# EAGLE design main_shema (EAGLE 8.5.2)
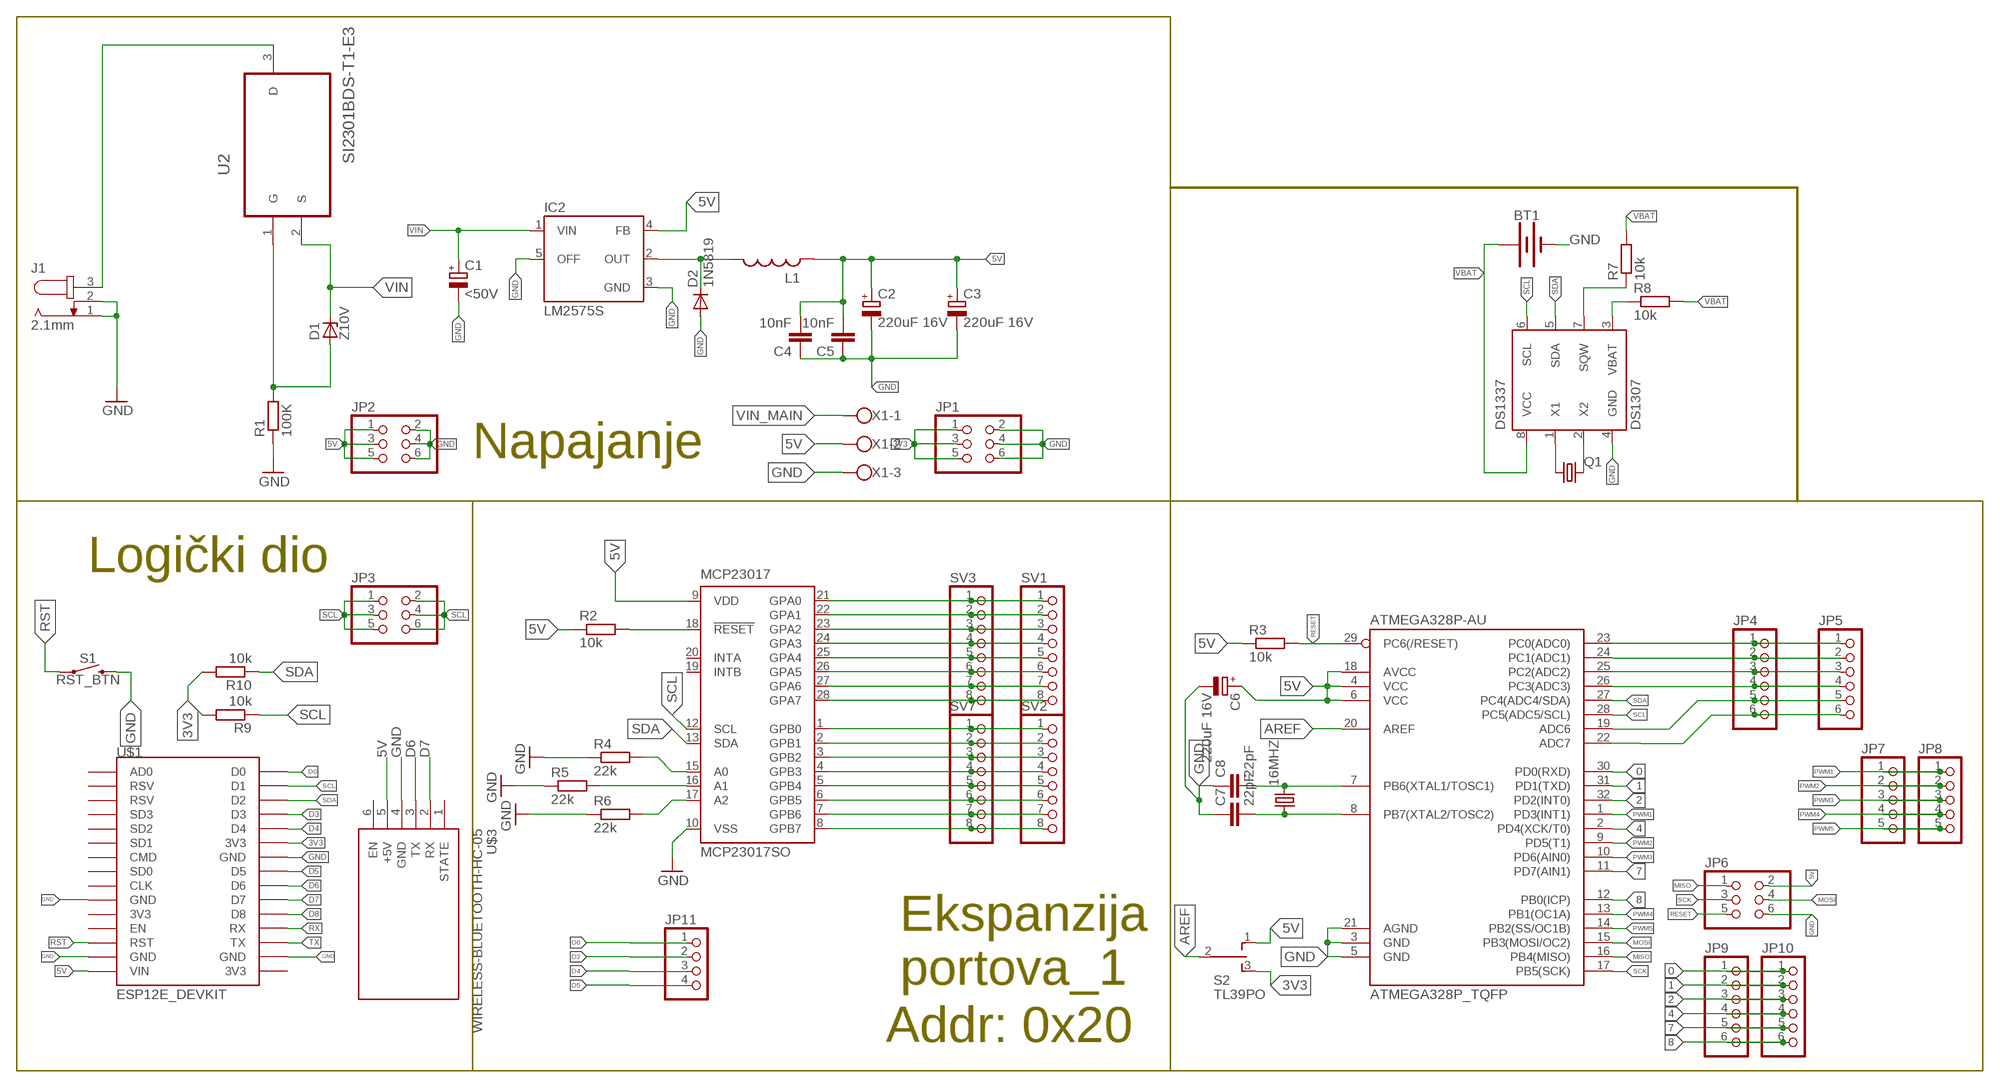
[diagram p0: schematic, sheet 1]

## Parts
16MHZ  CRYSTALHC49S  [HC49/S]
ATMEGA328P-AU  ATMEGA328P_TQFP  [TQFP32-08]
BT1  BATTERY-20MM_PTH  [BATTCOM_20MM_PTH]
C1  <50V  CPOL-EUE3.5-8  [E3,5-8]
C2  220uF 16V  CPOL-EUE2-5  [E2-5]
C3  220uF 16V  CPOL-EUE2-5  [E2-5]
C4  10nF  C-EU025-024X044  [C025-024X044]
C5  10nF  C-EU025-024X044  [C025-024X044]
C6  220uF 16V  CPOL-EUE2-5  [E2-5]
C7  22pF  C-EU025-024X044  [C025-024X044]
C8  22pF  C-EU025-024X044  [C025-024X044]
D1  Z10V  ZENER-DIODEDO35Z10  [DO35Z10]
D2  1N5819  1N4004  [DO41-10]
DS1337  DS1307  [DIL08]
IC2  LM2575S  [TO263-5]
J1  2.1mm  JACK-PLUG1  [SPC4078]
JP1  PINHD-2X3  [2X03]
JP2  PINHD-2X3  [2X03]
JP3  PINHD-2X3  [2X03]
JP4  PINHD-1X6  [1X06]
JP5  PINHD-1X6  [1X06]
JP6  PINHD-2X3  [2X03]
JP7  PINHD-1X5  [1X05]
JP8  PINHD-1X5  [1X05]
JP9  PINHD-1X6  [1X06]
JP10  PINHD-1X6  [1X06]
JP11  PINHD-1X4  [1X04]
L1  MSS1260  [MSS1260]
MCP23017  MCP23017SO  [SO28W]
Q1  CRYSTALTC38H  [TC38H]
R1  100K  R-EU_R1206  [R1206]
R2  10k  R-EU_R1206  [R1206]
R3  10k  R-EU_R1206  [R1206]
R4  22k  R-EU_R1206  [R1206]
R5  22k  R-EU_R1206  [R1206]
R6  22k  R-EU_R1206  [R1206]
R7  10k  R-EU_R1206  [R1206]
R8  10k  R-EU_R1206  [R1206]
R9  10k  R-EU_R1206  [R1206]
R10  10k  R-EU_R1206  [R1206]
S1  RST_BTN  MOMENTARY-SWITCH-SPST-PTH-6.0MM  [TACTILE_SWITCH_PTH_6.0MM]
S2  TL39PO  [TL3XPO]
SV1  PINHD-1X8  [1X08]
SV2  PINHD-1X8  [1X08]
SV3  PINHD-1X8  [1X08]
SV7  PINHD-1X8  [1X08]
U2  SI2301BDS-T1-E3  [SOT95P237X112-3N]
U$1  ESP12E_DEVKIT  [ESP12E_DEVKIT]
U$3  WIRELESS-BLUETOOTH-HC-05  [WIRELESS-BLUETOOTH-HC-05]
X1  W237-103  [W237-103]

## Nets
0: ATMEGA328P-AU.30(PD0(RXD)) JP9.1 JP10.1
1: ATMEGA328P-AU.31(PD1(TXD)) JP9.2 JP10.2
2: ATMEGA328P-AU.32(PD2(INT0)) JP9.3 JP10.3
3V3: JP1.1 JP1.3 JP1.5 R9.2 R10.2 S2.3(S) U$1.3V3@1(3V3)
4: ATMEGA328P-AU.2(PD4(XCK/T0)) JP9.4 JP10.4
5V: ATMEGA328P-AU.4(VCC) ATMEGA328P-AU.6(VCC) ATMEGA328P-AU.18(AVCC) C2.+ C3.+ C4.2 C5.2 C6.+ IC2.4(FB) JP2.1 JP2.3 JP2.5 JP6.2 L1.P$2 MCP23017.9(VDD) R2.1 R3.1 S2.1(O) U$1.VIN U$3.5(+5V) X1.2
7: ATMEGA328P-AU.11(PD7(AIN1)) JP9.5 JP10.5
8: ATMEGA328P-AU.12(PB0(ICP)) JP9.6 JP10.6
AREF: ATMEGA328P-AU.20(AREF) S2.2(P)
D0: JP11.1 U$1.D0
D3: JP11.2 U$1.D3
D4: JP11.3 U$1.D4
D5: JP11.4 U$1.D5
D6: U$1.D6 U$3.3(TX)
D7: U$1.D7 U$3.2(RX)
D8: U$1.D8
GND: ATMEGA328P-AU.3(GND) ATMEGA328P-AU.5(GND) ATMEGA328P-AU.21(AGND) BT1.2(-) C1.- C2.- C3.- C4.1 C5.1 C6.- C7.1 C8.1 D2.A DS1337.4(GND) IC2.3(GND) IC2.5(OFF) J1.1 J1.2 JP1.2 JP1.4 JP1.6 JP2.2 JP2.4 JP2.6 JP6.6 MCP23017.10(VSS) R1.1 R4.1 R5.1 R6.1 S1.3 U$1.GND@0(GND) U$1.GND@1(GND) U$1.GND@2(GND) U$1.GND@3(GND) U$3.4(GND) X1.3
MISO: ATMEGA328P-AU.16(PB4(MISO)) JP6.1
MOSI: ATMEGA328P-AU.15(PB3(MOSI/OC2)) JP6.4
N$1: DS1337.1(X1) Q1.1
N$2: D1.A R1.2 U2.1(G)
N$3: MCP23017.21(GPA0) SV1.1 SV3.1
N$4: MCP23017.22(GPA1) SV1.2 SV3.2
N$5: MCP23017.15(A0) R4.2
N$6: MCP23017.16(A1) R5.2
N$7: MCP23017.17(A2) R6.2
N$8: D2.C IC2.2(OUT) L1.P$1
N$9: DS1337.2(X2) Q1.2
N$10: ATMEGA328P-AU.22(ADC7) JP4.6 JP5.6
N$11: MCP23017.23(GPA2) SV1.3 SV3.3
N$13: DS1337.3(VBAT) R8.1
N$14: DS1337.7(SQW) R7.1
N$15: MCP23017.24(GPA3) SV1.4 SV3.4
N$16: MCP23017.25(GPA4) SV1.5 SV3.5
N$17: MCP23017.26(GPA5) SV1.6 SV3.6
N$18: MCP23017.18(!RESET) R2.2
N$19: 16MHZ.2 ATMEGA328P-AU.7(PB6(XTAL1/TOSC1)) C8.2
N$20: 16MHZ.1 ATMEGA328P-AU.8(PB7(XTAL2/TOSC2)) C7.2
N$21: MCP23017.27(GPA6) SV1.7 SV3.7
N$22: MCP23017.28(GPA7) SV1.8 SV3.8
N$23: MCP23017.1(GPB0) SV2.1 SV7.1
N$24: MCP23017.2(GPB1) SV2.2 SV7.2
N$25: MCP23017.3(GPB2) SV2.3 SV7.3
N$26: MCP23017.4(GPB3) SV2.4 SV7.4
N$27: MCP23017.5(GPB4) SV2.5 SV7.5
N$28: MCP23017.6(GPB5) SV2.6 SV7.6
N$29: MCP23017.7(GPB6) SV2.7 SV7.7
N$30: MCP23017.8(GPB7) SV2.8 SV7.8
N$31: ATMEGA328P-AU.23(PC0(ADC0)) JP4.1 JP5.1
N$32: ATMEGA328P-AU.24(PC1(ADC1)) JP4.2 JP5.2
N$33: ATMEGA328P-AU.25(PC2(ADC2)) JP4.3 JP5.3
N$34: ATMEGA328P-AU.26(PC3(ADC3)) JP4.4 JP5.4
N$35: ATMEGA328P-AU.19(ADC6) JP4.5 JP5.5
PWM1: ATMEGA328P-AU.1(PD3(INT1)) JP7.1 JP8.1
PWM2: ATMEGA328P-AU.9(PD5(T1)) JP7.2 JP8.2
PWM3: ATMEGA328P-AU.10(PD6(AIN0)) JP7.3 JP8.3
PWM4: ATMEGA328P-AU.13(PB1(OC1A)) JP7.4 JP8.4
PWM5: ATMEGA328P-AU.14(PB2(SS/OC1B)) JP7.5 JP8.5
RESET: ATMEGA328P-AU.29(PC6(/RESET)) JP6.5 R3.2
RST: S1.1 U$1.RST
RX: U$1.RX
SCK: ATMEGA328P-AU.17(PB5(SCK)) JP6.3
SCL: ATMEGA328P-AU.28(PC5(ADC5/SCL)) DS1337.6(SCL) JP3.1 JP3.3 JP3.5 MCP23017.12(SCL) R9.1 U$1.D1
SDA: ATMEGA328P-AU.27(PC4(ADC4/SDA)) DS1337.5(SDA) JP3.2 JP3.4 JP3.6 MCP23017.13(SDA) R10.1 U$1.D2
TX: U$1.TX
VBAT: BT1.1(+) DS1337.8(VCC) R7.2 R8.2
VIN: C1.+ D1.C IC2.1(VIN) U2.2(S)
VIN_MAIN: J1.3 U2.3(D) X1.1
Unconnected: MCP23017.19(INTB) MCP23017.20(INTA) U$1.3V3@0(3V3) U$1.3V3@2(3V3) U$1.AD0 U$1.CLK U$1.CMD U$1.EN U$1.RSV@0(RSV) U$1.RSV@1(RSV) U$1.SD0 U$1.SD1 U$1.SD2 U$1.SD3 U$3.1(STATE) U$3.6(EN)

## Notes on the sheet
- Napajanje
- Logički dio
- Ekspanzija
  portova_1
- Addr: 0x20

## Library data of the parts
16MHZ = crystal:CRYSTAL: CRYSTAL; OC_FARNELL: 1667008; OC_NEWARK: unknown
ATMEGA328P-AU = SparkFun-IC-Microcontroller:ATMEGA328P_TQFP: Popular 328P in QFP Storefront component: ATmega328 - TQFP <https://www.sparkfun.com/products/13448> (COM-13448) Datasheet <http://www.sparkfun.com/datasheets/Components/SMD/ATMega328.pdf> SparkFun Products SparkFun RedBoard - Programmed with Arduino <https://www.sparkfun.com/products/12757> (DEV-12757) Arduino Pro Mini 328 - 5V/16MHz <https://www.sparkfun.com/products/11113> (DEV-11113) Arduino Pro Mini 328 - 3.3V/8MHz <https://www.sparkfun.com/products/11114> (DEV-11114) SparkFun OpenLog <https://www.sparkfun.com/products/13712> (DEV-13712) SparkFun MicroView - OLED Arduino Module <https://www.sparkfun.com/products/12923> (DEV-12923) SparkFun Digital Sandbox <https://www.sparkfun.com/products/12651> (DEV-12651) SparkFun PicoBoard <https://www.sparkfun.com/products/11888> (WIG-11888) Arduino Fio <https://www.sparkfun.com/products/10116> (DEV-10116) LilyPad Arduino 328 Main Board <https://www.sparkfun.com/products/13342> (DEV-13342) SparkFun RedStick <https://www.sparkfun.com/products/13741> (DEV-13741) LilyPad MP3 <https://www.sparkfun.com/products/11013> (DEV-11013) LilyPad Arduino SimpleSnap <https://www.sparkfun.com/products/10941> (DEV-10941) SparkFun Stepoko <https://www.sparkfun.com/products/13899> (ROB-13899) SparkFun Geiger Counter <https://www.sparkfun.com/products/11345> (SEN-11345) SparkFun EL Sequencer <https://www.sparkfun.com/products/12781> (COM-12781) Arduino Pro 328 - 5V/16MHz <https://www.sparkfun.com/products/10915> (DEV-10915) CryptoCape <https://www.sparkfun.com/products/12773> (DEV-12773) SparkFun IR Thermometer Evaluation Board - MLX90614 <https://www.sparkfun.com/products/10740> (SEN-10740) SparkFun RedBot Mainboard <https://www.sparkfun.com/products/12097> (ROB-12097) Arduino Pro 328 - 3.3V/8MHz <https://www.sparkfun.com/products/10914> (DEV-10914) SparkFun Block for Intel® Edison - Arduino <https://www.sparkfun.com/products/13036> (DEV-13036) SparkFun Simon Says - Surface Mount Soldering Kit <https://www.sparkfun.com/products/10935> (KIT-10935) SparkFun 7-Segment Serial Display - Red <https://www.sparkfun.com/products/11441> (COM-11441) SparkFun 7-Segment Serial Display - White <https://www.sparkfun.com/products/11629> (COM-11629) SparkFun 7-Segment Serial Display - Yellow <https://www.sparkfun.com/products/11443> (COM-11443) SparkFun 7-Segment Serial Display - Kelly Green <https://www.sparkfun.com/products/11440> (COM-11440) SparkFun 7-Segment Serial Display - Blue <https://www.sparkfun.com/products/11442> (COM-11442) SparkFun OpenSegment Serial Display - 20mm (Blue) <https://www.sparkfun.com/products/11647> (COM-11647) SparkFun OpenSegment Serial Display - 20mm (Green) <https://www.sparkfun.com/products/11646> (COM-11646) SparkFun OpenSegment Serial Display - 20mm (White) <https://www.sparkfun.com/products/11648> (COM-11648) SparkFun OpenSegment Serial Display - 20mm (Red) <https://www.sparkfun.com/products/11644> (COM-11644) SparkFun OpenSegment Serial Display - 20mm (Yellow) <https://www.sparkfun.com/products/11645> (COM-11645) SparkFun OpenSegment Shield <https://www.sparkfun.com/products/13190> (DEV-13190); PROD_ID: IC-09069
BT1 = SparkFun-Batteries:BATTERY: Battery - Single Cell A variety of battery chemistries, sizes, and footprints. Device List: 20MM_PTH - Coin Cell Battery Holder - 20mm (PTH) <https://www.sparkfun.com/products/783> 12MM_SMD - Coin Cell Battery Holder - 12mm (SMD) <https://www.sparkfun.com/products/10592> 12MM_PTH - Coin Cell Battery Holder - 12mm (PTH) <https://www.sparkfun.com/products/7948> 20MM_SMD - 20mm Coin Cell Battery Holder (SMD) (2 legs) Used on the Big Time Watch Kit <https://www.sparkfun.com/products/11734> 20MM_SMD_4LEGS - Coin Cell Battery Holder - 20mm (SMD) <https://www.sparkfun.com/products/11892> 20MM_SMD_4LEGS_OVERPASTE - Coin Cell Battery Holder - 20mm (SMD) <https://www.sparkfun.com/products/11892> (Over-paste on the legs) 24.5MM_PTH - Coin Cell Battery Holder - 24.5mm (PTH) <https://www.sparkfun.com/products/8863> 9V - 9V Battery Holder - PC Mount Used on the SparkFun SparkPunk Sound Kit <https://www.sparkfun.com/products/11177> and SparkFun SparkPunk Sequencer Kit <https://www.sparkfun.com/products/12707> 18650 - Battery Holder - 18650 (PTH) <https://www.sparkfun.com/products/13113> AA - Battery Holder - 1xAA (PTH) <https://www.sparkfun.com/products/7949> AAA - Battery Holder - 1xAAA (PTH) <https://www.sparkfun.com/products/12718> AA_KIT - Battery Holder - 1xAA (PTH) <https://www.sparkfun.com/products/7949> Special kit package - pads only have exposed copper on one side of the board. AAA_KIT - Battery Holder - 1xAAA (PTH) <https://www.sparkfun.com/products/12718> Special kit package - pads only have exposed copper on one side of the board.; PROD_ID: BATT-09031; SF_SKU: PRT-00783
C1-C3 C6 = resistor:CPOL-EU: POLARIZED CAPACITOR, European symbol
C4 C5 C7 C8 = resistor:C-EU: CAPACITOR, European symbol
D1 = diode:ZENER-DIODE: Z-Diode
D2 = diode:1N4004: DIODE general purpose rectifier, 1 A
DS1337 = ds1307_pcf8583:DS1307: I2C-Bus CLOCK/CALENDAR
IC2 = v-reg-3:LM2575: National Semiconductor <http://www.national.com> 1.0A "Simple Switcher"(c) 52kHz, Vout 1.23-37V (HV: 57V), Vin 40V (HV: 60V), 50µA standby current
J1 = con-jack:JACK-PLUG: DC POWER JACK Power Jack, DC, Right Angle, Through Hole, Rated 5A at 16VDC, PC Terminals Distributor: Farnell (www.Farnell.de) Drawing: 84N1161.pdf / 84N1162.pdf Manufacturer: SPC Technology (www.spctechnology.com) Type: SPC4077 / SPC 4078; OC_FARNELL: unknown; OC_NEWARK: unknown
JP1 JP3 JP6 = pinhead_2:PINHD-2X3: PIN HEADER
JP2 = pinhead:PINHD-2X3: PIN HEADER
JP4 JP5 JP9 JP10 = pinhead_2:PINHD-1X6: PIN HEADER
JP7 JP8 = pinhead_2:PINHD-1X5: PIN HEADER
JP11 = pinhead:PINHD-1X4: PIN HEADER
L1 = inductor-coilcraft:MSS1260: SMT Power Inductor
MCP23017 = microchip:MCP23017: http://ww1.microchip.com/downloads/en/DeviceDoc/21952a.pdf Source: http://ww1.microchip.com/downloads/en/DeviceDoc/21952a.pdf; MF: MICROCHIP; MPN: MCP23017-E/SO; OC_FARNELL: 1332087; OC_NEWARK: 31K2958
Q1 = crystal:CRYSTAL: CRYSTAL; OC_FARNELL: unknown; OC_NEWARK: unknown
R1-R10 = resistor:R-EU_: RESISTOR, European symbol
S1 = SparkFun-Switches:MOMENTARY-SWITCH-SPST: Momentary Switch (Pushbutton) - SPST Normally-open (NO) SPST momentary switches (buttons, pushbuttons). Variants PTH-12MM - 12mm square, through-hole Momentary Pushbutton Switch - 12mm Square <https://www.sparkfun.com/products/9190> (COM-09190) PTH-6.0MM, PTH-6.0MM-KIT - 6.0mm square, through-hole Mini Pushbutton Switch <https://www.sparkfun.com/products/97> (COM-00097) KIT package intended for soldering kit's - only one side of pads' copper is exposed. PTH-RIGHT-ANGLE-KIT - Right-angle, through-hole Right Angle Tactile Button <https://www.sparkfun.com/products/10791> - Used on SparkFun BigTime Watch Kit <https://www.sparkfun.com/products/11734> SMD-12MM - 12mm square, surface-mount Tactile Button - SMD (12mm) <https://www.sparkfun.com/products/12993> (COM-12993) Used on SparkFun PicoBoard <https://www.sparkfun.com/products/11888> SMD-4.5MM - 4.5mm Square Trackball Switch Used on SparkFun Blackberry Trackballer Breakout <https://www.sparkfun.com/products/13169> SMD-4.6MMX2.8MM - 4.60mm x 2.80mm, surface mount Used on SparkFun SAMD21 Mini Breakout <https://www.sparkfun.com/products/13664> SMD-5.2MM, SMD-5.2-REDUNDANT - 5.2mm square, surface-mount Mini Pushbutton Switch - SMD <https://www.sparkfun.com/products/8720> (COM-08720) Used on Arduino Pro Mini <https://www.sparkfun.com/products/11114> REDUNDANT package connects both switch circuits together SMD-6.0X3.5MM - 6.0 x 3.5mm, surface mount Momentary Reset Switch SMD <https://www.sparkfun.com/products/8229> (COM-08229) SMD-6.2MM-TALL - 6.2mm square, surface mount Tactile Button - SMD (6mm) <https://www.sparkfun.com/products/12992> Used on SparkFun Digital Sandbox <https://www.sparkfun.com/products/12651> SMD-RIGHT-ANGLE - Right-angle, surface mount Used on SparkFun Block for Intel® Edison - Arduino <https://www.sparkfun.com/products/13036>; PROD_ID: SWCH-08441; SF_SKU: COM-00097
S2 = switch:TL39PO: TINY SWITCH ON OFF ON Source: http://www2.produktinfo.conrad.com/datenblaetter/700000-724999/705152-da-01-de-Subminiaturschalter_TL_36YO.pdf
SV1-SV3 SV7 = pinhead_2:PINHD-1X8: PIN HEADER
U2 = Vishay_By_element14_Batch_1:SI2301BDS-T1-E3: MOSFET; MPN: SI2301BDS-T1-E3; OC_FARNELL: 1470099; OC_NEWARK: 06J7561; PACKAGE: SOT-23-3; SUPPLIER: VISHAY
U$1 = esp:ESP12E_DEVKIT: ESP12E DEVKIT BOARD
U$3 = diy-modules:WIRELESS-BLUETOOTH-HC-05: Bluetooth Transceiver Module based on HC-05 board Tutorial is available here: https://arduino-info.wikispaces.com/BlueTooth-HC05-HC06-Modules-How-To Click here to find device on ebay.com <http://www.ebay.com/sch/hc-05+module+rs232>
X1 = con-wago-500:W237-103: WAGO SCREW CLAMP; MPN: 237-103; OC_FARNELL: unknown; OC_NEWARK: 18M7116

## Board
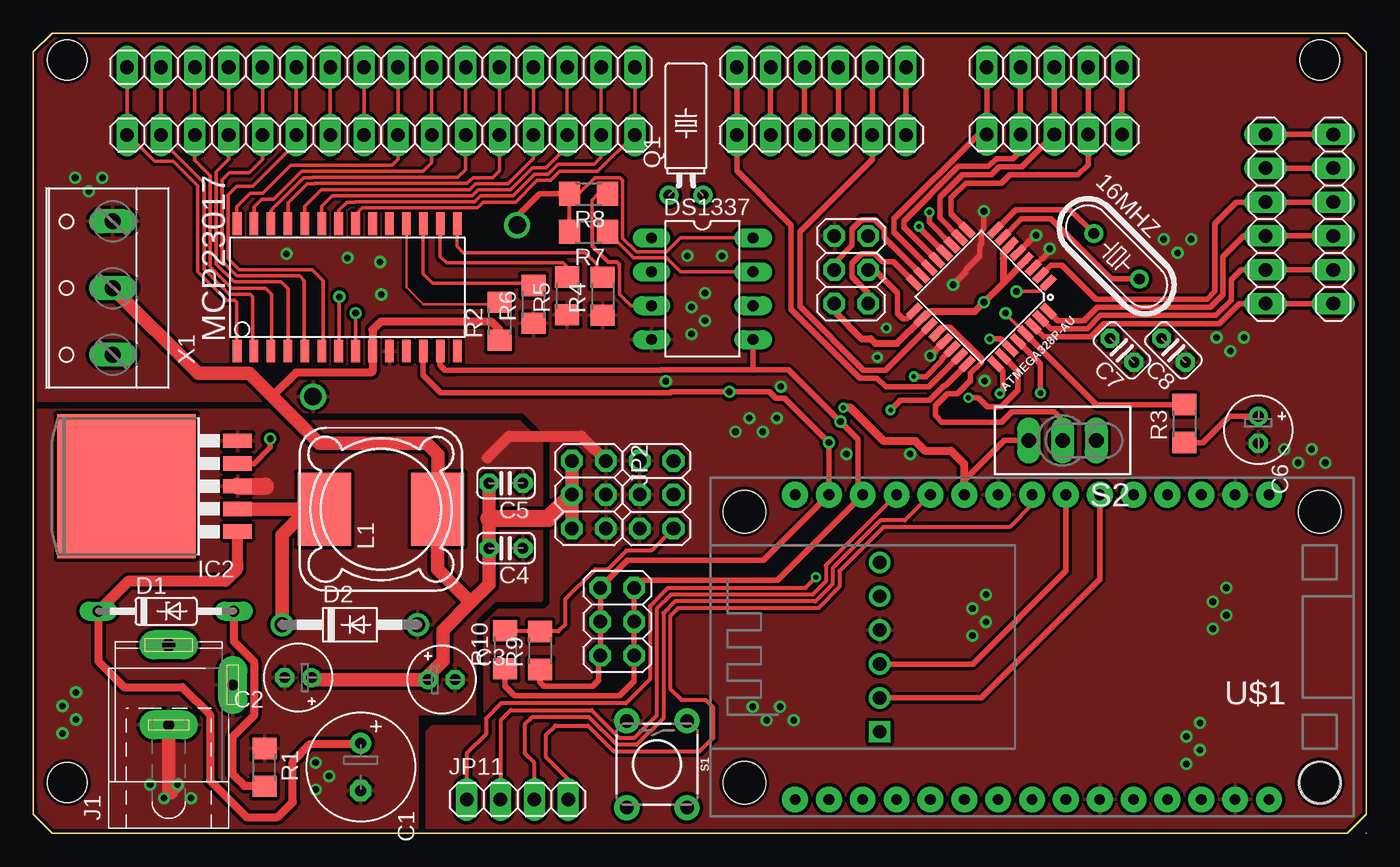
[diagram p1: board, top side]
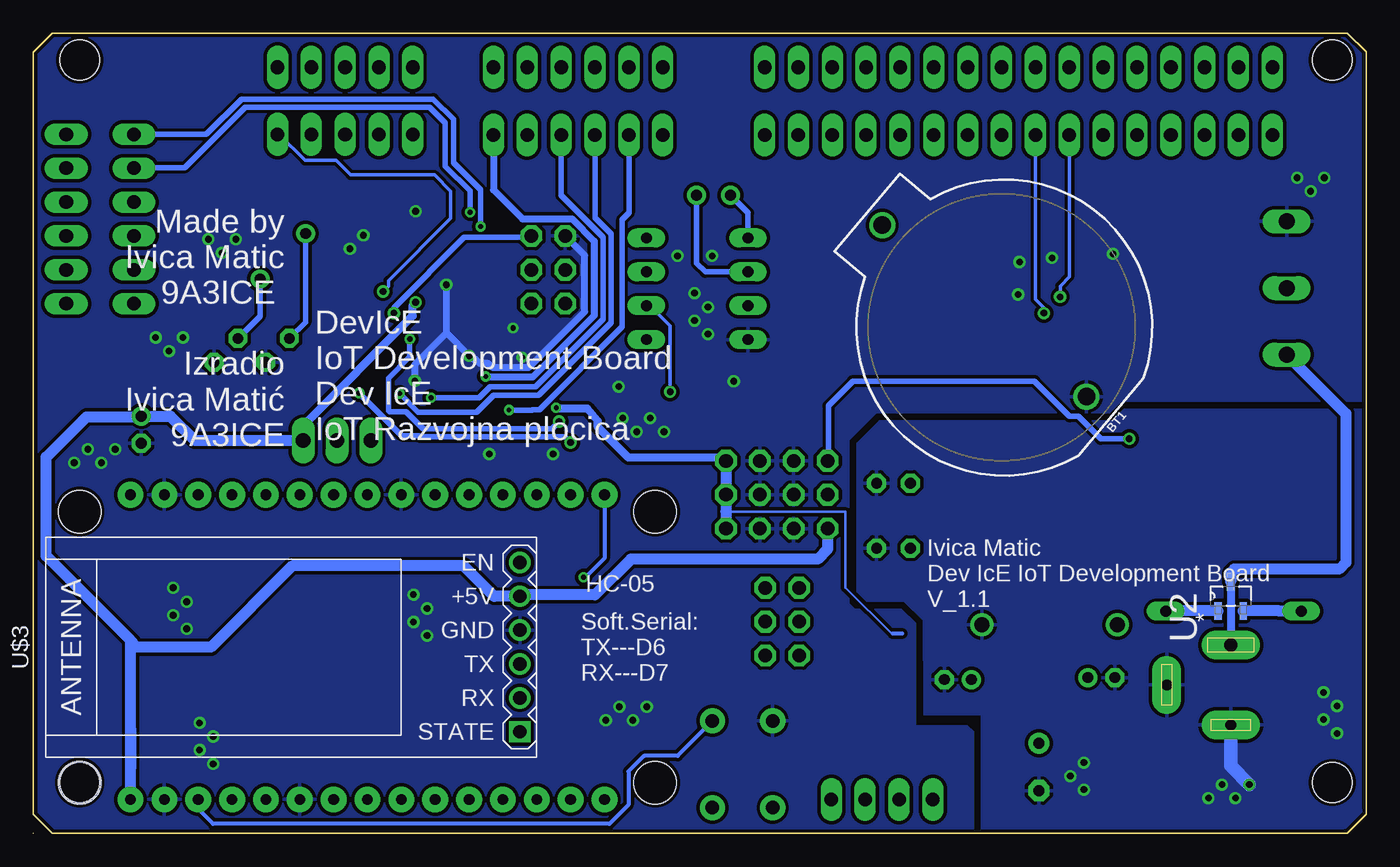
[diagram p2: board, bottom side, seen from below]

Size 100 x 60 mm. Coordinates in mm from the lower left corner, seen from the top.
Outline: 98.55,59.99 1.42,60 0,58.62 0,1.93 0,1.42 1.42,0
Outline: 98.55,59.99 98.56,60
Outline: 100,58.57 100,58.57
Outline: 100,58.57 100,1.42 98.58,0
Outline: 98.58,0 98.55,0
Outline: 98.55,0 1.63,0
Outline: 1.63,0 1.42,0
Outline: 1.42,0 1.63,0
Outline: 98.58,0 98.55,0
Outline: 98.55,59.99 98.58,59.99 100,58.57
Outline: 100,0 100,0
Copper layers (1*16): Top 0.035mm / dielectric 1.5mm / Bottom 0.035mm
Design rules "default *": minimum track width 8mil, minimum drill 0.4mm, track to track 8mil, track to pad 8mil, pad to pad 8mil, via to via 8mil, smd to smd 8mil, copper to edge 10mil, drill to drill 6mil, minimum pad ring 12mil, minimum via ring 8mil, stop-mask expansion 4mil, vias tented up to drill 0mil, thermal gap 10mil
Holes 3 mm at 2.54,3.81 2.54,58 96.52,58 96.52,3.81

### Footprints (pad centres in the part's own frame; a part is rotated, then mirrored left to right if it is on the bottom)
HC49/S = drill 0.813: 1 -2.413,0; 2 2.413,0
TQFP32-08 = smd 1.27 x 0.559: 1 -4.293,2.8; 2 -4.293,2; 3 -4.293,1.2; 4 -4.293,0.4; 5 -4.293,-0.4; 6 -4.293,-1.2; 7 -4.293,-2; 8 -4.293,-2.8; 17 4.293,-2.8; 18 4.293,-2; 19 4.293,-1.2; 20 4.293,-0.4; 21 4.293,0.4; 22 4.293,1.2; 23 4.293,2; 24 4.293,2.8 | smd 0.559 x 1.27: 9 -2.8,-4.293; 10 -2,-4.293; 11 -1.2,-4.293; 12 -0.4,-4.293; 13 0.4,-4.293; 14 1.2,-4.293; 15 2,-4.293; 16 2.8,-4.293; 25 2.8,4.293; 26 2,4.293; 27 1.2,4.293; 28 0.4,4.293; 29 -0.4,4.293; 30 -1.2,4.293; 31 -2,4.293; 32 -2.8,4.293
BATTCOM_20MM_PTH = drill 1.3: 1 11.85,0; 2 -8.15,0
E3,5-8 = drill 0.813 pad 1.6: + -1.778,0 | drill 0.813 pad 1.6 octagon: - 1.778,0
E2-5 = drill 0.813 pad 1.27: + -1.016,0 | drill 0.813 pad 1.27 octagon: - 1.016,0
C025-024X044 = drill 0.813 octagon: 1 -1.27,0; 2 1.27,0
DO35Z10 = drill 0.813 long: A 5.08,0; C -5.08,0
DO41-10 = drill 1.118: A 5.08,0; C -5.08,0
DIL08 = drill 0.813 long: 1 -3.81,-3.81; 2 -1.27,-3.81; 3 1.27,-3.81; 4 3.81,-3.81; 5 3.81,3.81; 6 1.27,3.81; 7 -1.27,3.81; 8 -3.81,3.81
TO263-5 = smd 1.067 x 2.159: 1 -3.404,-5.791; 2 -1.702,-5.791; 3 0,-5.791; 4 1.702,-5.791; 5 3.404,-5.791 | smd 10.8 x 10.41: 6 0,2.54
SPC4078 = drill 0.8 pad 2.184 long: 1 -3,0; 2 0,-4.8 | drill 1 pad 2.184 long: 3 3,0
2X03 = drill 1.016 octagon: 1 -2.54,-1.27; 2 -2.54,1.27; 3 0,-1.27; 4 0,1.27; 5 2.54,-1.27; 6 2.54,1.27
1X06 = drill 1.016 long: 1 -6.35,0; 2 -3.81,0; 3 -1.27,0; 4 1.27,0; 5 3.81,0; 6 6.35,0
1X05 = drill 1.016 long: 1 -5.08,0; 2 -2.54,0; 3 0,0; 4 2.54,0; 5 5.08,0
1X04 = drill 1.016 long: 1 -3.81,0; 2 -1.27,0; 3 1.27,0; 4 3.81,0
MSS1260 = smd 5.5 x 4: P$1 0,4.25; P$2 0,-4.25
SO28W = smd 0.65 x 1.7: 1 -7.62,-4.78; 2 -6.35,-4.78; 3 -5.08,-4.78; 4 -3.81,-4.78; 5 -2.54,-4.78; 6 -1.27,-4.78; 7 0,-4.78; 8 1.27,-4.78; 9 2.54,-4.78; 10 3.81,-4.78; 11 5.08,-4.78; 12 6.35,-4.78; 13 7.62,-4.78; 14 8.89,-4.78; 15 8.89,4.78; 16 7.62,4.78; 17 6.35,4.78; 18 5.08,4.78; 19 3.81,4.78; 20 2.54,4.78; 21 1.27,4.78; 22 0,4.78; 23 -1.27,4.78; 24 -2.54,4.78; 25 -3.81,4.78; 26 -5.08,4.78; 27 -6.35,4.78; 28 -7.62,4.78
TC38H = drill 0.813: 1 -1.27,0; 2 1.27,0
R1206 = smd 1.6 x 1.803: 1 -1.422,0; 2 1.422,0
TACTILE_SWITCH_PTH_6.0MM = drill 1.016 pad 1.88: 1 -3.251,2.261; 2 3.251,2.261; 3 -3.251,-2.261; 4 3.251,-2.261
TL3XPO = drill 1.1 pad 1.422 long: 1 -2.54,0; 2 0,0; 3 2.54,0
1X08 = drill 1.016 long: 1 -8.89,0; 2 -6.35,0; 3 -3.81,0; 4 -1.27,0; 5 1.27,0; 6 3.81,0; 7 6.35,0; 8 8.89,0
SOT95P237X112-3N = smd 1.321 x 0.559: 1 -1.092,0.94; 2 -1.092,-0.94; 3 1.092,0
ESP12E_DEVKIT = drill 0.8 pad 1.93: 3V3@0 -11.43,-7.62; 3V3@1 11.43,5.08; 3V3@2 11.43,-17.78; AD0 -11.43,17.78; CLK -11.43,-2.54; CMD -11.43,2.54; D0 11.43,17.78; D1 11.43,15.24; D2 11.43,12.7; D3 11.43,10.16; D4 11.43,7.62; D5 11.43,0; D6 11.43,-2.54; D7 11.43,-5.08; D8 11.43,-7.62; EN -11.43,-10.16; GND@0 -11.43,-5.08; GND@1 -11.43,-15.24; GND@2 11.43,2.54; GND@3 11.43,-15.24; RST -11.43,-12.7; RSV@0 -11.43,15.24; RSV@1 -11.43,12.7; RX 11.43,-10.16; SD0 -11.43,0; SD1 -11.43,5.08; SD2 -11.43,7.62; SD3 -11.43,10.16; TX 11.43,-12.7; VIN -11.43,-17.78 | hole 3.2: -10.16,21.59; 10.16,21.59; 10.16,-21.59; -10.16,-21.59
WIRELESS-BLUETOOTH-HC-05 = drill 1 square: 1 -6.35,-17.145 | drill 1: 2 -3.81,-17.145; 3 -1.27,-17.145; 4 1.27,-17.145; 5 3.81,-17.145; 6 6.35,-17.145
W237-103 = drill 1.194 long: 1 -5,-1.29; 2 0,-1.29; 3 5,-1.29

### Placement (x,y rotation side)
16MHZ  81.28,43.28 315 top
ATMEGA328P-AU  71.12,40.23 225 top
BT1  27.23,38 140 bottom
C1  24.56,4.98 270 top
C2  19.86,11.68 180 top
C3  30.63,11.53 0 top
C4  35.46,21.39 180 top
C5  35.46,26.26 180 top
C6  91.9,30.28 270 top
C7  81.69,36.22 135 top
C8  85.55,36.22 135 top
D1  9.96,16.66 0 top
D2  23.75,15.65 0 top
DS1337  50.19,40.84 270 top
IC2  9.53,26.04 90 top
J1  10.16,11.13 90 top
JP1  46.76,25.4 90 top
JP2  41.68,25.4 270 top
JP3  43.81,15.88 270 top
JP4  59.13,57.45 0 top
JP5  59.13,52.37 0 top
JP6  61.37,42.27 90 top
JP7  76.61,57.45 180 top
JP8  76.61,52.43 180 top
JP9  97.53,46.08 90 top
JP10  92.46,46.08 90 top
JP11  36.32,2.54 0 top
L1  26.08,24.31 90 top
MCP23017  22.91,40.94 0 top
Q1  48.97,47.85 0 top
R1  17.35,4.95 270 top
R2  34.98,38.4 90 top
R3  86.36,30.73 90 top
R4  42.72,40.28 90 top
R5  40.06,40.31 90 top
R6  37.52,39.67 90 top
R7  41.66,45.11 180 top
R8  41.66,47.96 180 top
R9  38.02,13.72 90 top
R10  35.41,13.77 90 top
S1  46.79,5.18 270 top
S2  77.22,29.46 180 top
SV1  36.25,52.37 180 top
SV2  15.93,52.37 0 top
SV3  36.25,57.45 180 top
SV7  15.93,57.45 0 top
U2  10.16,17.78 90 bottom
U$1  74.93,13.97 90 top
U$3  80.64,13.97 90 bottom
X1  4.67,40.89 90 top

### Tracks (layer width: path | path; a pad name or v marks a point on that pad's centre or on a via)
0
  Top 0.406: ATMEGA328P-AU.30 75.81,37.24 79.33,37.24 80.33,38.24 88.98,38.24 90.47,39.73 JP10.1 JP9.1
1
  Top 0.203: 97.47,42.23 JP9.2
  Top 0.406: ATMEGA328P-AU.31 76.34,37.85 79.07,37.85 80.07,38.85 88.73,38.85 89.86,39.98 89.86,41.5 90.63,42.27 JP10.2 97.43,42.27 97.47,42.23
2
  Top 0.203: 97.47,44.77 JP9.3
  Top 0.406: ATMEGA328P-AU.32 76.86,38.46 78.82,38.46 79.82,39.45 88.32,39.45 89.26,40.39 89.26,43.23 90.83,44.81 JP10.3 97.43,44.81 97.47,44.77
3V3  (via drill 0.35)
  Top 0.305: 35.51,14.99 R10.2 37.97,15.19 R9.2 39.37,15.14 39.93,15.7 39.93,17.58 42.16,19.81 43.11,19.81 44.5,21.21 46.38,21.21 JP1.1
  Top 0.406: U$1.3V3@1 69.85,26.47 72.85,29.46 S2.3
  Top 0.61: U$1.3V3@1 69.85,27.69 68.83,28.7 66.89,28.7 66.18,29.41 63.81,29.41 61.29,31.92 v60.77,31.92
  Bottom 0.203: 35.51,14.99 35.56,14.92 39.05,18.41 39.05,24.13 47.94,24.13 48.03,24.13
  Bottom 0.305: 34.8,14.99 35.51,14.99
  Bottom 0.61: JP1.5 48.28,28.19 55.37,28.19 57.66,30.48 57.66,30.93 58.42,31.85 60.7,31.85 v60.77,31.92 60.88,31.92 60.8,31.85 | JP1.1 48.03,24.13 48.03,25.45
  Bottom 0.813: JP1.5 48.03,25.45 | JP1.3 48.03,24.13 JP1.1
4
  Top 0.406: ATMEGA328P-AU.2 76.34,42.62 77.17,42.62 79.72,40.06 88.07,40.06 88.65,40.64 88.65,45.72 90.27,47.35 JP10.4 JP9.4
5V  (via drill 0.5)
  Top 0.254: 74.44,42.94 ATMEGA328P-AU.4 | ATMEGA328P-AU.6
  Top 0.406: L1.P$2 30.33,23.42 | R3.1 87.73,29.31 89.71,31.29 C6.+ | IC2.4 16.56,27.74 17.78,28.96 v17.78,29.59
  Top 0.508: JP6.2 60.1,39.14 62.13,37.11 62.81,37.11 63.17,36.75 64.81,36.75 ATMEGA328P-AU.18 66.76,38.61 67.3,39.15 70.65,39.15 v71.32,39.83 72.77,41.27 | ATMEGA328P-AU.4 74.44,42.94 72.77,41.27 | ATMEGA328P-AU.6 73.31,44.03 72.77,43.49 72.77,43.11 72.77,41.27
  Top 0.61: 34.98,36.96 R2.1 34.98,37.77 34.34,38.41 26.09,38.41 25.45,37.77 MCP23017.9 25.45,34.65 25.35,34.54 19.71,34.54 17.93,32.77
  Top 1.016: JP2.5 JP2.3 JP2.1 | 32.82,17.32 34.19,18.69 C4.2 34.19,23.62 C5.2 | 32.82,17.32 30.73,15.24 30.73,12.95 29.46,11.68 C3.+ 21.03,11.53 C2.+ | 32.82,17.32 30.33,19.81 30.33,23.42 30.33,23.93 30.38,23.98 30.38,28.4 29.52,29.26 21.44,29.26 17.93,32.77 16.2,34.5 12.36,34.5 X1.2
  Top 1.27: 34.19,23.62 38.63,23.62 JP2.3
  Bottom 0.305: 24.89,33.91 25.04,33.91 | 35.51,33.91 35.56,33.91 | 40.41,28.09 JP2.1
  Bottom 0.406: 24.89,33.91 22.25,31.27 21.59,31.27 19.91,29.59 v17.78,29.59 | 25.04,33.91 35.51,33.91 | 35.56,33.91 38.51,33.91 40.35,32.07 40.35,28.16 40.41,28.09
  Bottom 0.61: S2.1 79.76,30.58 71.53,38.81 71.53,39.62 v71.32,39.83 | U$1.VIN 92.71,4.83 92.71,5.33
  Bottom 0.813: 92.71,14.48 99.03,20.8 99.03,28.22 96.01,31.24 91.95,31.24 C6.+ 89.71,31.29 87.88,29.46 S2.1 | 92.71,7.87 92.71,14.48 | 92.71,7.87 92.71,5.33 | 92.71,5.33 92.71,4.83 | U$1.VIN 92.71,5.33 | 92.71,5.33 92.71,7.87 | JP2.5 40.41,21.31 41.15,20.57 55.17,20.57 57.86,17.88 64.01,17.88 63.6,17.88 U$3.5 65.43,17.78 67.72,20.07 80.57,20.07 86.67,13.97 92.2,13.97 92.71,14.48
7  (via drill 0.35)
  Top 0.406: ATMEGA328P-AU.11 67.24,45.81 v67.24,46.58 | JP9.5 JP10.5
  Bottom 0.406: v67.24,46.58 67.24,48.19 69.09,50.04 69.09,53.29 70.26,54.46 84.12,54.46 88.65,49.94 92.41,49.94 JP10.5
8  (via drill 0.35)
  Top 0.254: ATMEGA328P-AU.12 66.95,44.96
  Top 0.406: v66.45,45.51 66.45,45.47 ATMEGA328P-AU.12 | JP10.6 JP9.6
  Bottom 0.406: JP10.6 87.02,52.43 84.38,55.07 70,55.07 68.48,53.54 68.48,50.29 66.45,48.26 66.45,46.74 66.45,46.73 v66.45,45.51
AREF
  Top 0.406: S2.2 77.22,30.99 76.6,31.6 73.4,31.6 72.64,30.84 68.17,30.84 67.67,31.34 67.67,32.05 68.58,32.97 69.34,32.97 70.31,33.94 70.31,34.49 71.12,35.3 71.12,35.64 68.79,37.97 68.29,37.97 ATMEGA328P-AU.20
D0  (via drill 0.35)
  Top 0.305: JP11.1 32.51,5.99 33.96,7.44 33.96,8.61 35.1,9.75 44.46,9.75 46.25,11.55 46.25,17.04 47.62,18.41 57.94,18.41 v58.73,19.2
  Bottom 0.305: U$1.D0 57.15,20.62 58.62,19.15 58.67,19.15 v58.73,19.2
D3
  Top 0.305: U$1.D3 59.46,20.09 59.46,18.9 58.47,17.91 47.84,17.91 46.76,16.83 46.76,8.84 45.06,7.14 43.99,7.14 41.88,9.25 35.81,9.25 35.1,8.53 35.1,2.59 JP11.2
D4
  Top 0.305: U$1.D4 65.38,23.47 63.56,23.47 59.97,19.88 59.97,18.69 58.68,17.4 48.16,17.4 47.27,16.51 47.27,8.63 45.27,6.63 43.78,6.63 41.67,8.74 37.44,8.74 36.91,8.2 36.91,5.97 37.59,5.28 JP11.3
D5
  Top 0.305: U$1.D5 74.93,24.64 73.25,22.96 63.77,22.96 60.48,19.67 60.48,18.48 58.89,16.89 48.39,16.89 48.31,16.82 | 48.31,16.82 48.21,16.71 | 48.31,16.82 47.78,16.28 47.78,10.85 48.62,10.01 50.44,10.01 51,9.45 51,7.16 49.96,6.12 43.57,6.12 41.61,8.08 39.17,8.08 38.48,7.39 38.48,5.71 40.13,4.06 JP11.4
D6
  Top 0.406: U$1.D6 77.47,19.68 70.48,12.7 U$3.3
D7
  Top 0.254: 80.01,25.25 U$1.D7 | 71.14,10.19 71.12,10.16 70.97,10.16
  Top 0.406: U$3.2 70.97,10.16 | 71.14,10.19 80.01,19.05 80.01,25.25
GND  (via drill 0.4, 0.5)
  Top 0.203: 68.58,36.83 ATMEGA328P-AU.21 | 73.66,43.18 ATMEGA328P-AU.5 74.3,43.81 74.7,44.25 74.93,44.45 | 75.56,43.18 74.93,42.55 ATMEGA328P-AU.3
  Top 0.406: v71.32,46.66 71.32,45.37 71.12,45.17 71.12,44.2 71.02,44.09 71.02,43.33 69.98,42.28 69.98,42.11 v69.01,41.15 | ATMEGA328P-AU.5 75.18,44.86 v75.23,44.86 | ATMEGA328P-AU.3 76.25,43.67 v76.25,43.84
  Top 0.508: v67.3,35.82 67.3,35.85 ATMEGA328P-AU.21
  Top 0.813: 34.06,28.14 35.71,29.79 41.1,29.79 JP2.2
  Top 1.016: J1.1 10.16,3.23 10.34,3.05 10.34,3.17 v10.82,3.66
  Top 1.27: IC2.3 17.4,26.04 17.42,26.01
  Bottom 0.508: 69.01,37.54 v67.3,35.83 v67.3,35.82 67.04,35.56 66.83,35.56 66.52,35.25 65.87,35.25 65.54,34.92 62.83,34.92 58.63,39.12 58.63,43.34 JP6.6 | 69.01,37.54 69.01,38.3 v69.01,41.15 | v71.37,33.93 71.37,35.18 69.01,37.54
  Bottom 1.016: J1.1 10.16,5.05 v8.76,3.66
  other vias: 26.01,42.85 56.08,33.5 47.45,33.91 65.79,28.45 19,43.46 23.57,43.15 26.11,40.41 61.01,28.45 64.01,37.9 63.32,35.71 88.77,37.19 90.83,37.19 89.81,36.17 2.18,7.49 2.18,9.55 3.2,8.53 3.2,10.57 9.8,2.64 11.84,2.64 93.85,28.8 95.91,28.8 94.89,27.79 96.93,27.79 22.2,4.29 21.18,5.31 21.18,3.28 4.17,48.16 5.18,49.17 3.15,49.17 50.39,40.51 50.39,38.46 49.38,39.47 49.38,37.44 54.74,30.12 52.68,30.12 55.78,31.14 53.72,31.14 71.48,17.91 71.48,15.85 70.46,16.87 70.46,14.83 89.51,18.41 89.51,16.36 88.49,17.37 88.49,15.34 86.51,5.21 86.51,7.26 87.53,6.25 87.53,8.28 51.66,43.31 49.07,43.31 53.98,9.5 56.03,9.5 55.02,8.48 57.05,8.48 84.81,44.55 86.87,44.55 85.85,43.54
  pour Top (isolate 0.254): 62.87,27.3 47.62,27.3 47.62,22.23 46.99,21.59 45.49,21.59 40.64,19.68 40.64,11.43 41.27,10.79 45.09,10.79 46.35,12.06 46.99,12.06 47.62,12.7 47.62,17.14 48.26,17.78 56.52,17.78 63.5,24.77 63.5,26.67
  pour Bottom (isolate 0.254): 0.05,31.8 18.14,31.8 19,30.94 36.47,30.94 38.2,29.21 38.2,17.48 38.15,17.42 34.65,17.42 33.22,16 33.17,9.8 33.17,8.89 28.85,8.84 28.85,0 1.42,0 0,1.42 0,31.75
  pour Top (isolate 0.254): 0.05,31.8 18.14,31.8 19,30.94 36.47,30.94 38.2,29.21 38.2,17.48 38.15,17.42 34.65,17.42 33.22,16 33.17,9.8 33.17,8.89 28.85,8.84 28.85,0 1.42,0 0,1.42 0,31.75
  pour Bottom (isolate 0.254): 0,32.41 18.39,32.41 19.25,31.55 36.78,31.55 38.81,29.51 38.81,17.22 38.4,16.81 34.9,16.81 33.83,15.75 33.83,8.08 29.97,8.08 29.46,7.62 29.46,0 98.6,0 100.03,1.42 100.03,58.57 98.6,59.99 1.37,59.99 0,58.62
  pour Top (isolate 0.254): 0,32.41 18.39,32.41 19.25,31.55 36.78,31.55 38.81,29.51 38.81,17.22 38.4,16.81 34.9,16.81 33.83,15.75 33.83,8.08 29.92,8.08 29.46,7.62 29.46,0 98.6,0 100.03,1.42 100.03,58.57 98.6,59.99 1.37,59.99 0,58.62
MISO
  Top 0.406: ATMEGA328P-AU.16 64.52,42.88 63.75,42.88 63.14,43.48 62.13,43.48 61.42,42.77 61.42,41.76 62.64,40.54 JP6.1
MOSI
  Top 0.406: ATMEGA328P-AU.15 63.86,44.67 63.86,45.31 63.14,46.02 62.13,46.02 61.42,45.31 61.42,44.09 60.1,42.77 JP6.4
N$1
  Bottom 0.406: DS1337.1 46.38,46.53 Q1.1
N$2
  Top 0.61: D1.A 15.04,14.4 16.56,12.88 16.56,8.84 14.94,7.21 14.94,4.47 15.85,3.56 17.32,3.56 R1.2
  Bottom 0.61: 13.79,16.69 U2.1
  Bottom 0.813: U2.1 15.01,16.69 D1.A
N$3
  Top 0.203: MCP23017.21 24.13,46.35 24.18,46.33
  Top 0.254: 24.13,46.35 24.68,46.91 33.29,46.91 33.43,47.04 33.73,47.35 36.17,47.35 37.8,48.97 38.81,48.97 39.48,49.64 42.33,49.64 45.06,52.38 SV1.1 SV3.1
N$4
  Top 0.254: 24.18,47.36 33.1,47.36 33.54,47.8 35.98,47.8 37.61,49.43 38.62,49.43 39.38,50.19 42.06,50.19 42.6,50.72 SV1.2 SV3.2 | 24.15,47.34 24.18,47.36 | MCP23017.22 22.91,46.72 23.53,47.34 24.15,47.34 | 24.15,47.34 24.18,47.36
N$5
  Top 0.254: 31.85,45.77 MCP23017.15 31.8,44.02 32.26,43.56 41.4,43.56 42.29,42.67 42.29,42.14 R4.2
N$6
  Top 0.254: MCP23017.16 30.53,43.26 30.99,42.8 39.75,42.8 40.06,42.49 R5.2
N$7
  Top 0.254: MCP23017.17 29.26,41.99 29.97,41.27 37.34,41.27 R6.2
N$8
  Top 1.016: D2.C 18.67,22.38 20.6,24.31 L1.P$1 15.34,24.31 IC2.2
N$9
  Bottom 0.406: Q1.2 50.24,42.77 49.58,42.11 DS1337.2
N$10  (via drill 0.35)
  Top 0.406: ATMEGA328P-AU.22 68.16,35.58 68.16,35.47 66.95,34.26 v66.06,34.26 | JP4.6 JP5.6
  Bottom 0.508: JP5.6 65.48,48.26 63.3,46.08 59.57,46.08 57.92,44.42 57.92,38.83 62.53,34.21 65.83,34.21 65.88,34.26 v66.06,34.26
N$11
  Top 0.203: SV3.3 40.06,52.32
  Top 0.254: SV1.3 40.06,52.32 40.06,52.22 | 40.06,52.22 40.06,51.51 38.47,49.92 37.45,49.92 35.79,48.26 33.35,48.26 32.91,47.82 22.42,47.82 21.64,47.04 MCP23017.23 | SV3.3 40.06,52.22
N$13
  Top 0.254: DS1337.3 44.86,39.57 43.99,40.44 43.99,42.57 43.98,42.58 | R8.1 42.37,47.95 41.91,47.5 41.91,45.99 41.92,45.97
  Top 0.305: 41.92,45.97 41.92,44.06 43.12,42.86 43.77,42.86 43.98,42.65 43.98,42.58
N$14
  Top 0.254: DS1337.7 48.56,42.11 47.52,43.16 45.03,43.16 R7.1
N$15
  Top 0.203: 37.52,52.43 37.52,52.12
  Top 0.254: SV1.4 37.52,52.12 37.52,50.63 35.61,48.72 33.17,48.72 32.72,48.28 21.61,48.28 20.37,47.04 MCP23017.24 | SV3.4 37.52,52.43
N$16
  Top 0.203: SV3.5 SV1.5
  Top 0.254: 32.71,48.91 32.98,49.18 34.45,49.18 34.98,49.71 34.98,52.27 | 32.71,48.91 | 32.71,48.91 32.54,48.74 21.12,48.74 21.11,48.73 20.53,48.73 19.1,47.3 MCP23017.25 | SV1.5 34.98,52.27 | SV3.5 34.98,52.27
N$17
  Top 0.254: MCP23017.26 17.83,46.74 18.19,47.09 18.2,47.09 20.3,49.19 20.92,49.19 20.93,49.2 31.85,49.2 32.44,49.78 SV1.6 SV3.6
N$18
  Top 0.203: MCP23017.18 27.99,40.95 29.26,39.67 34.82,39.67 R2.2
N$19
  Top 0.406: ATMEGA328P-AU.7 74.13,46.08 76.35,46.08 80.85,41.58 16MHZ.2
  Bottom 0.406: 16MHZ.2 82.99,38.78 C8.2
N$20
  Top 0.406: ATMEGA328P-AU.8 73.71,46.79 77.78,46.79 16MHZ.1
  Bottom 0.406: 16MHZ.1 79.57,38.33 C7.2
N$21
  Top 0.203: 29.9,54.91 SV1.7 | SV3.7 29.9,52.22
  Top 0.254: SV1.7 29.9,52.22 29.9,52.17 | 29.9,52.17 29.9,50.29 29.26,49.66 20.12,49.66 18.01,47.55 17.12,47.55 16.56,46.99 MCP23017.27 | SV3.7 29.9,52.17
N$22
  Top 0.254: MCP23017.28 15.24,45.78 15.24,46.99 16.26,48.01 17.2,48.01 19.31,50.11 26.92,50.11 27.36,50.55 SV1.8 SV3.8
N$23
  Top 0.203: SV2.1 SV7.1
  Top 0.254: 7.15,52.38 7.23,52.29 | 7.23,52.29 9.1,50.42 10.5,50.42 12.34,48.58 12.34,42.13 14.5,39.98 15.09,39.98 15.24,39.83 15.24,36.22 MCP23017.1 | SV7.1 7.04,52.49 7.23,52.29
N$24
  Top 0.203: SV7.2 9.53,57.15 9.53,52.7 SV2.2
  Top 0.254: 9.58,51.99 9.58,52.27 | 9.58,52.27 SV2.2 | MCP23017.2 16.46,36.27 16.46,40.23 16.26,40.44 14.69,40.44 12.8,42.32 12.8,48.77 9.58,51.99 | 9.58,52.27 9.58,51.99 | SV7.2 9.58,52.27
N$25
  Top 0.203: SV7.3 SV2.3
  Top 0.254: 12.12,52.27 12.12,50.47 13.26,49.33 13.26,42.51 14.88,40.89 17.42,40.89 17.88,40.44 17.88,36.22 MCP23017.3 | 12.12,52.27 SV2.3 | SV7.3 12.12,52.27
N$26
  Top 0.203: SV7.4 SV2.4
  Top 0.254: 14.66,51.82 14.66,50.55 13.72,49.61 13.72,42.7 15.06,41.35 18.59,41.35 19.1,40.84 MCP23017.4 | 14.66,51.82 14.66,52.12 | 14.66,52.12 SV2.4 | 14.66,52.12 14.66,51.82 | SV7.4 14.66,52.12
N$27
  Top 0.203: SV7.5 SV2.5
  Top 0.254: 17.2,52.17 17.2,50.55 16.18,49.53 14.68,49.53 14.17,49.02 14.17,42.89 15.25,41.81 19.96,41.81 20.32,41.45 20.32,36.22 MCP23017.5 | 17.2,52.17 17.2,52.32 | 17.2,52.32 SV2.5 | 17.2,52.32 17.2,52.17 | SV7.5 17.2,52.32
N$28
  Top 0.254: MCP23017.6 21.74,36.27 21.74,41.45 20.93,42.27 15.44,42.27 14.63,43.08 14.64,43.08 14.64,47.91 15.24,48.51 16.44,48.51 19.74,51.81 SV2.6 SV7.6
N$29  (via drill 0.5)
  Top 0.203: 22.28,52.48 SV2.7
  Top 0.254: v22.96,40.23 22.96,36.22 MCP23017.7 | SV7.7 22.28,52.48
  Bottom 0.254: SV2.7 22.28,41.73 22.96,41.05 v22.96,40.23
N$30  (via drill 0.5)
  Top 0.254: v24.18,39.01 MCP23017.8 | SV7.8 SV2.8
  Bottom 0.254: SV2.8 24.82,40.06 24.18,39.42 v24.18,39.01
N$31
  Top 0.406: ATMEGA328P-AU.23 67.19,33.48 63.96,33.48 63.3,34.14 62.03,34.14 56.84,39.32 56.84,45.62 52.78,49.68 JP5.1 JP4.1
N$32  (via drill 0.35)
  Top 0.406: ATMEGA328P-AU.24 68.42,33.58 68.33,33.58 67.24,32.49 65.05,32.49 v64.31,31.75 | JP4.2 JP5.2
  Bottom 0.406: JP5.2 55.32,46.53 55.83,46.02 55.83,37.98 62.03,31.77 62.55,31.77 62.58,31.75 v64.31,31.75
N$33  (via drill 0.35)
  Top 0.406: ATMEGA328P-AU.25 72.75,34.65 72.75,33.22 v72.52,32.99 | JP4.3 JP5.3
  Bottom 0.406: v72.52,32.99 71.13,31.6 66.75,31.6 65.48,32.87 62.08,32.87 56.65,38.3 56.65,44.95 57.86,46.16 57.86,52.22 JP5.3
N$34  (via drill 0.35)
  Top 0.406: ATMEGA328P-AU.26 73.83,34.7 73.86,34.7 73.86,33.22 72.64,32 71.58,32 70.92,32.66 v70.16,32.66 v70.15,32.67 | JP4.4 JP5.4
  Bottom 0.406: JP5.4 60.4,47.84 57.26,44.7 57.26,38.55 61.62,34.19 62.34,33.48 63.09,33.48 65.73,33.48 66.54,32.67 v70.15,32.67
N$35
  Top 0.254: 62.94,52.32 JP5.5 | 62.43,34.75 62.28,34.75 | 63.8,34.75 63.94,34.75
  Top 0.406: ATMEGA328P-AU.19 63.94,34.75 63.8,34.75 62.43,34.75 | 62.28,34.75 57.51,39.52 57.51,45.11 62.94,50.55 62.94,52.32 | JP4.5 JP5.5
PWM1  (via drill 0.5)
  Top 0.254: v73.76,40.64 75.49,40.64 ATMEGA328P-AU.1
  Top 0.406: JP8.1 JP7.1
  Bottom 0.254: JP8.1 81.58,52.43 79.62,50.47 77.29,50.47 76.2,49.38 69.9,49.38 68.68,48.16 68.68,46.13 73.36,41.45 73.36,41.05 v73.76,40.64
PWM2
  Top 0.203: 79.14,57.43 JP7.2
  Top 0.406: ATMEGA328P-AU.9 68.83,46.48 68.83,47.65 69.95,48.77 72.64,48.77 73.25,49.38 78.38,49.38 79.15,50.14 JP8.2 79.14,52.43 79.14,57.43
PWM3
  Top 0.406: ATMEGA328P-AU.10 68.02,46.16 68.02,47.7 69.7,49.38 71.88,49.38 72.49,49.99 74.17,49.99 JP8.3 JP7.3
PWM4
  Top 0.406: ATMEGA328P-AU.13 65.33,45.46 65.33,45.92 69.42,50.01 71.65,50.01 72.24,50.6 73.51,50.6 74.07,51.16 JP8.4 JP7.4
PWM5
  Top 0.254: 70.92,52.43 70.87,52.38
  Top 0.406: 70.92,52.43 JP8.5 JP7.5 | 70.87,52.38 64.57,46.08 64.57,45.09 ATMEGA328P-AU.14
RESET  (via drill 0.5)
  Top 0.254: 74.46,37.48 ATMEGA328P-AU.29 72.95,38.97 v72.95,39.01
  Top 0.406: ATMEGA328P-AU.29 79.76,32.16 R3.2
  Bottom 0.406: JP6.5 62.74,44.7 67.67,44.7 72.95,39.42 v72.95,39.01
RST
  Bottom 0.305: S1.1 51.66,5.82 54.17,5.82 55.35,4.64 55.35,2.13 56.77,0.71 86.51,0.71 87.83,2.03 87.63,2.23 U$1.RST
SCK
  Top 0.406: ATMEGA328P-AU.17 65.53,38.61 65.23,38.61 64.82,39.01 64.82,40.54 63.09,42.27 JP6.3
SCL  (via drill 0.4, 0.5)
  Top 0.203: v52.22,33.12 52.39,33.02 52.39,33.12
  Top 0.254: MCP23017.12 29.26,35.83 29.26,35.61 arc45 29.34,35.44 | 59.69,29.21 v59.69,29.31 | JP3.1 42.55,18.49 42.55,18.57 44.48,20.5
  Top 0.406: MCP23017.12 29.26,34.34 30.55,33.05 47.8,33.05 47.88,33.12 v52.22,33.12 52.39,33.12 55.25,33.12 55.73,32.64 56.36,32.64 v59.69,29.31 | 59.69,29.21 U$1.D1 54.79,20.5 44.58,20.5 42.58,18.49 42.55,18.49 | JP3.5 42.39,13.18 | 42.39,13.18 42.39,11.48 41.96,11.05 38.33,11.05 38,11.38 38,12.27 R9.1 | JP3.1 JP3.3 JP3.5 | JP3.5 42.39,13.18 | v75.56,33.02 75.56,35.22 ATMEGA328P-AU.28
  Bottom 0.254: DS1337.6 54,39.83 52.25,38.07 52.25,33.15 v52.22,33.12
  Bottom 0.406: v75.56,33.02 72.36,29.82 71.07,29.82 71,29.74 60.12,29.74 v59.69,29.31
SDA  (via drill 0.4, 0.5)
  Top 0.203: ATMEGA328P-AU.27 73.03,36.83
  Top 0.254: 53.94,34.75 31.65,34.75 31.39,34.75 31.29,34.75 | 53.94,34.75 56.69,34.75 v60.55,30.89 60.6,30.84 | 54,34.81 53.94,34.75
  Top 0.406: v60.55,30.89 56.69,34.75 56.67,34.77 54,34.77 47.09,34.77 47.07,34.75 31.65,34.75 | 31.65,34.75 31.39,34.75 | MCP23017.13 30.53,35.1 30.89,34.75 31.29,34.75 31.65,34.75 | 60.6,30.84 61.87,29.57 61.87,25.76 U$1.D2 55.83,19 45.67,19 JP3.2 JP3.4 JP3.6 45.09,11.4 43.99,10.31 36.12,10.31 35.41,11.02 R10.1 | DS1337.5 54,34.81 | ATMEGA328P-AU.27 72.57,37.08 v71.75,37.08
  Bottom 0.254: 73.36,31.7 73.28,31.62 | 61.16,30.28 v60.55,30.89 | 71.75,35.74 72.03,35.46
  Bottom 0.406: v71.75,37.08 71.75,35.74 73.36,34.14 73.36,31.7 | 73.28,31.62 72.02,31.62 70.75,30.35 63.6,30.35 | 63.6,30.35 62.99,30.35 | 62.99,30.35 63.6,30.35 | v60.55,30.89 61.09,30.35 62.99,30.35
VBAT
  Top 0.254: DS1337.8 48.56,44.65 47.52,43.61 45.24,43.61 44.21,44.64 44.21,48.99 44.02,49.19 42.14,49.19 40.91,47.95 40.03,47.95
  Top 0.305: R7.2 R8.2
  Top 0.406: 40.8,47.95 R8.2 40.03,47.95 38,47.95 36.31,46.26 BT1.1
VIN
  Top 0.61: D1.C 4.88,12.9 6.81,10.97 11.18,10.97 13.26,8.89 13.26,3.96 16,1.22 18.34,1.22 19.46,2.34 19.46,5.38 20.78,6.71 24.51,6.71 C1.+
  Top 0.813: IC2.1 15.32,20.34 15.32,19.79 14.73,19.2 14.43,18.9 7.11,18.9 D1.C
  Bottom 0.813: U2.2 6.53,16.69 6.5,16.66 D1.C
VIN_MAIN
  Bottom 0.61: U2.3 J1.3
  Bottom 0.813: 1.52,31.5 1.52,30.53 | 1.52,30.53 1.52,20.32 2.03,19.81 9.91,19.81 10.16,19.56 U2.3 | X1.1 1.52,31.45 1.52,30.53

### Text on the board
_tNames: V1.1 | 1 | 2 | 3 | 4 | 5 | 6 | 7 | 8 | 9 | 10 | 11 | 12 | 13 | 14 | 15 | 16 | 1 | 2 | 3 | 4 | 5 | 6 | 5 | 4 | 3 | 2 | 1 | 03/2018 | 8 | 32.768MHz | 7 | R8 | IO_read(x) | IO_write(x) | ADC_read(x) | PWM_write(x) | 4 | 16MHz | GND | 1 | 4 | 2 | R7 | 2 | 5 | TX | 5V | 3 | 6 | RX | MCP23017 | 1-GND | 4-RESET | R6 | R5 | R4 | 2-MOSI | 5-SCK | VIN | DS1337_RTC | R2 | 3-5V | 6-MISO | C7 | C8 | 3V3 | ATMega328P-AU | 5V | C6 | GND | GND | L1 | AREF | 3V3 | 5V | R3 | C5 | LM2575-5 | C4 | ESP8266 | SDA | SCL | NODEmcu | Ako ovo mozes procitat / sam sastavljas plocicu, / svaka ti cast! | ZD1 | D2 | C3 | C2 | R9 | RST | If you can read this / that means that you are / assembling this board by / yourself. / Well done! | R10 | R1 | DC IN | 40V MAX!!! | Q0 | Q1 | Q2 | Q3 | C1 | J1 | 3v3 Only!!!
_bNames: Made by / Ivica Matic / 9A3ICE / / Izradio / Ivica Matić / 9A3ICE | DevIcE / IoT Development Board / Dev IcE / IoT Razvojna plocica | HC-05 | Ivica Matic / Dev IcE IoT Development Board / V_1.1 | Soft.Serial: / TX---D6 / RX---D7
200bmp: C:/Users/Ivica/Desktop/preuzmi.bmp | C:/Users/Ivica/Desktop/preuzmi.bmp